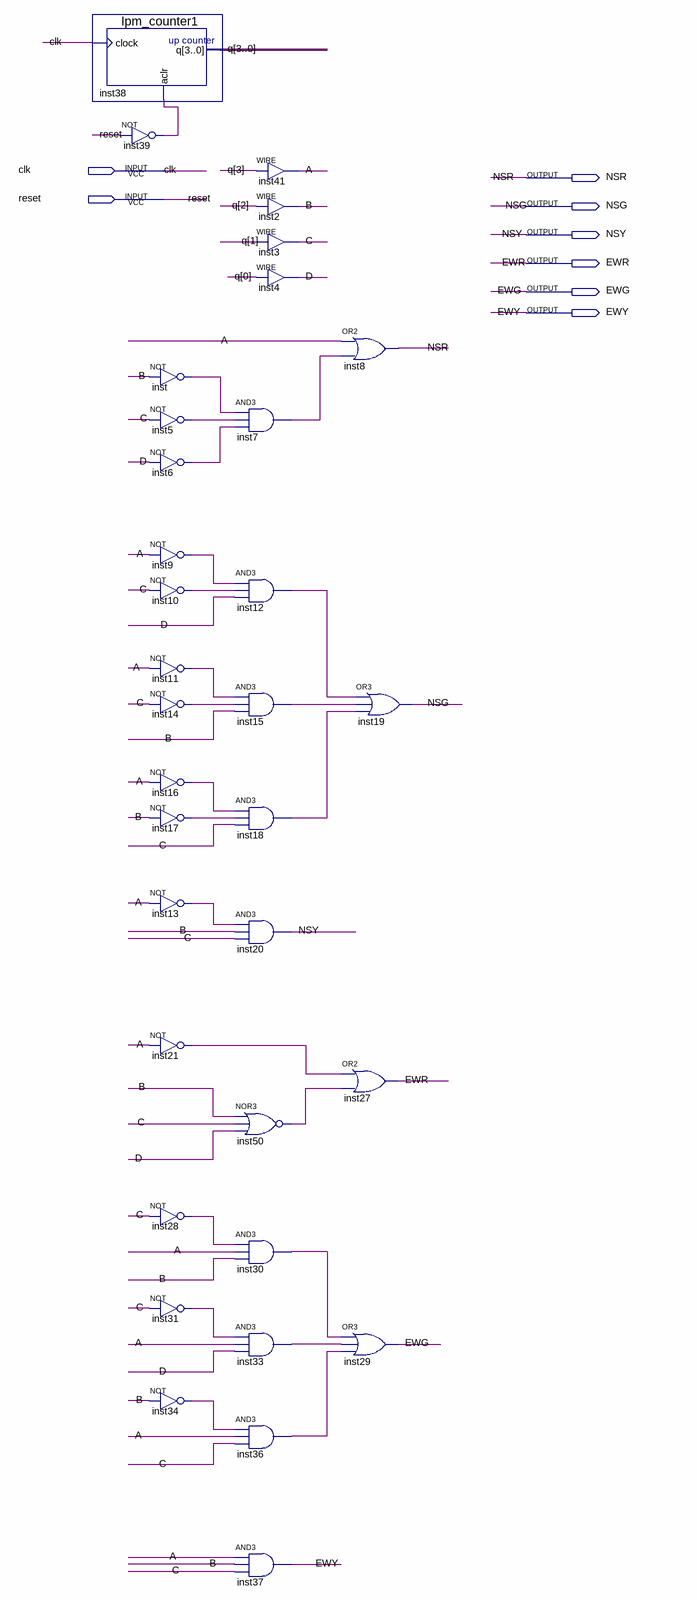
[diagram p0: schematic sheet]
// Quartus schematic task.bdf as structural Verilog: 34 symbols, 8 pins
module \task  (
  input  clk,
  input  reset,
  output NSR,
  output NSG,
  output NSY,
  output EWR,
  output EWG,
  output EWY
);

  wire A, B, C, D, inst5_out, inst6_out, inst7_out, inst9_out, inst10_out, inst11_out, inst12_out,
       inst13_out, inst14_out, inst15_out, inst16_out, inst17_out, inst18_out, inst21_out, inst28_out,
       inst30_out, inst31_out, inst33_out, inst34_out, inst36_out, inst39_out, inst50_out, inst_out;
  wire [3:0] q;

  lpm_counter1 inst38 (.clock(clk), .aclr(inst39_out), .q(q));
  not inst39 (inst39_out, reset);
  not inst (inst_out, B);
  not inst5 (inst5_out, C);
  not inst6 (inst6_out, D);
  not inst9 (inst9_out, A);
  not inst10 (inst10_out, C);
  not inst11 (inst11_out, A);
  not inst14 (inst14_out, C);
  not inst16 (inst16_out, A);
  not inst17 (inst17_out, B);
  not inst13 (inst13_out, A);
  not inst21 (inst21_out, A);
  not inst28 (inst28_out, C);
  not inst31 (inst31_out, C);
  not inst34 (inst34_out, B);
  assign A = q[3];  // WIRE inst41
  assign B = q[2];  // WIRE inst2
  assign C = q[1];  // WIRE inst3
  assign D = q[0];  // WIRE inst4
  and inst7 (inst7_out, inst_out, inst5_out, inst6_out);
  and inst12 (inst12_out, inst9_out, inst10_out, D);
  and inst15 (inst15_out, inst11_out, inst14_out, B);
  and inst18 (inst18_out, inst16_out, inst17_out, C);
  and inst20 (NSY, inst13_out, B, C);
  nor inst50 (inst50_out, B, C, D);
  and inst30 (inst30_out, inst28_out, A, B);
  and inst33 (inst33_out, inst31_out, A, D);
  and inst36 (inst36_out, inst34_out, A, C);
  and inst37 (EWY, A, B, C);
  or inst8 (NSR, A, inst7_out);
  or inst19 (NSG, inst12_out, inst15_out, inst18_out);
  or inst27 (EWR, inst21_out, inst50_out);
  or inst29 (EWG, inst30_out, inst33_out, inst36_out);
endmodule
